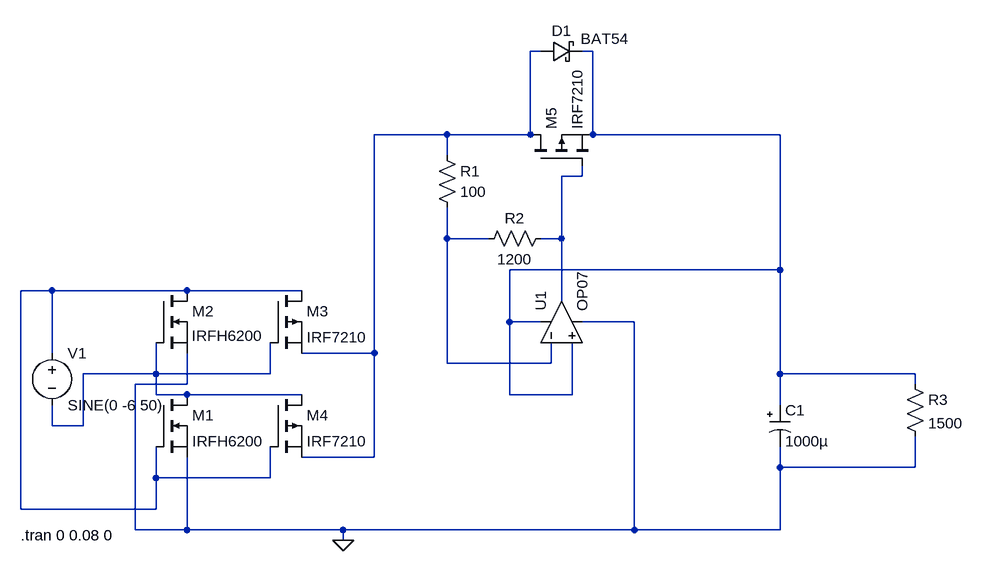
[diagram p0: schematic low_voltage_drop_rectifier.asc]
low_voltage_drop_rectifier.asc, the LTspice schematic file:
Version 4
SHEET 1 880 680
WIRE 96 -608 80 -608
WIRE 176 -608 160 -608
WIRE -48 -480 -160 -480
WIRE 80 -480 80 -608
WIRE 80 -480 -48 -480
WIRE 176 -480 176 -608
WIRE 464 -480 176 -480
WIRE -48 -448 -48 -480
WIRE 160 -416 160 -432
WIRE 160 -416 128 -416
WIRE -48 -320 -48 -368
WIRE 16 -320 -48 -320
WIRE 128 -320 128 -416
WIRE 128 -320 96 -320
WIRE 464 -272 464 -480
WIRE 464 -272 48 -272
WIRE -656 -240 -704 -240
WIRE -448 -240 -656 -240
WIRE -272 -240 -448 -240
WIRE 128 -224 128 -320
WIRE 48 -192 48 -272
WIRE 96 -192 48 -192
WIRE 240 -192 160 -192
WIRE -656 -144 -656 -240
WIRE -160 -144 -160 -480
WIRE -160 -144 -272 -144
WIRE -48 -128 -48 -320
WIRE 112 -128 112 -160
WIRE 112 -128 -48 -128
WIRE -496 -112 -496 -160
WIRE -496 -112 -608 -112
WIRE -320 -112 -320 -160
WIRE -320 -112 -496 -112
WIRE 464 -112 464 -272
WIRE 672 -112 464 -112
WIRE -448 -96 -448 -144
WIRE -448 -96 -528 -96
WIRE 672 -96 672 -112
WIRE -496 -80 -496 -112
WIRE -448 -80 -496 -80
WIRE -272 -80 -448 -80
WIRE 48 -80 48 -192
WIRE 144 -80 144 -160
WIRE 144 -80 48 -80
WIRE 464 -64 464 -112
WIRE -656 -32 -656 -64
WIRE -608 -32 -608 -112
WIRE -608 -32 -656 -32
WIRE -160 16 -160 -144
WIRE -160 16 -272 16
WIRE 464 32 464 0
WIRE 672 32 672 -16
WIRE 672 32 464 32
WIRE -496 48 -496 0
WIRE -320 48 -320 0
WIRE -320 48 -496 48
WIRE -704 96 -704 -240
WIRE -496 96 -496 48
WIRE -496 96 -704 96
WIRE -528 128 -528 -96
WIRE -448 128 -448 16
WIRE -448 128 -528 128
WIRE -208 128 -448 128
WIRE 240 128 240 -192
WIRE 240 128 -208 128
WIRE 464 128 464 32
WIRE 464 128 240 128
WIRE -208 144 -208 128
FLAG -208 144 0
SYMBOL nmos -496 -80 R0
SYMATTR InstName M1
SYMATTR Value IRFH6200
SYMBOL nmos -496 -240 R0
WINDOW 3 55 69 Left 2
SYMATTR Value IRFH6200
SYMATTR InstName M2
SYMBOL pmos -320 -240 R0
SYMATTR InstName M3
SYMATTR Value IRF7210
SYMBOL pmos -320 -80 R0
SYMATTR InstName M4
SYMATTR Value IRF7210
SYMBOL voltage -656 -160 R0
WINDOW 123 0 0 Left 2
WINDOW 39 0 0 Left 2
SYMATTR InstName V1
SYMATTR Value SINE(0 -6 50)
SYMBOL polcap 448 -64 R0
WINDOW 3 24 56 Left 2
SYMATTR Value 1000µ
SYMATTR InstName C1
SYMATTR Description Capacitor
SYMATTR Type cap
SYMATTR SpiceLine V=16 Irms=1.41 Rser=0.047 Lser=0 mfg="Nichicon" pn="UPL1C102MPH" type="Al electrolytic"
SYMBOL res -64 -464 R0
WINDOW 3 36 72 Left 2
SYMATTR Value 100
SYMATTR InstName R1
SYMBOL res 112 -336 R90
WINDOW 0 0 56 VBottom 2
WINDOW 3 32 56 VTop 2
SYMATTR InstName R2
SYMATTR Value 1200
SYMBOL pmos 80 -432 R270
SYMATTR InstName M5
SYMATTR Value IRF7210
SYMBOL Opamps\\OP07 64 -192 R270
SYMATTR InstName U1
SYMBOL res 656 -112 R0
SYMATTR InstName R3
SYMATTR Value 1500
SYMBOL schottky 96 -592 R270
WINDOW 0 32 32 VTop 2
WINDOW 3 51 98 VBottom 2
SYMATTR InstName D1
SYMATTR Value BAT54
SYMATTR Description Diode
SYMATTR Type diode
TEXT -704 136 Left 2 !.tran 0 0.08 0

The netlist it stands for:
* low_voltage_drop_rectifier.asc
M1 N006 N005 0 0 IRFH6200
M2 N005 N006 0 0 IRFH6200
M3 N005 N006 N001 N001 IRF7210
M4 N006 N005 N001 N001 IRF7210
V1 N005 N006 SINE(0 -6 50)
C1 N002 0 1000µ V=16 Irms=1.41 Rser=0.047 Lser=0 mfg="Nichicon" pn="UPL1C102MPH" type="Al electrolytic"
R1 N001 N004 100
R2 N003 N004 1200
M5 N001 N003 N002 N002 IRF7210
XU1 N002 N004 N002 0 N003 LT1001  ; OP07, pins In+ In- V+ V- OUT
R3 N002 0 1500
D1 N001 N002 BAT54
.model D D
.lib standard.dio
.model NMOS NMOS
.model PMOS PMOS
.lib standard.mos
.tran 0 0.08 0
.lib LTC.lib
.backanno
.end